# Altium schematic sheet 01_CPU.SchDoc
size A3; DocumentNumber: 1; SheetNumber: 1; SheetTotal: 5
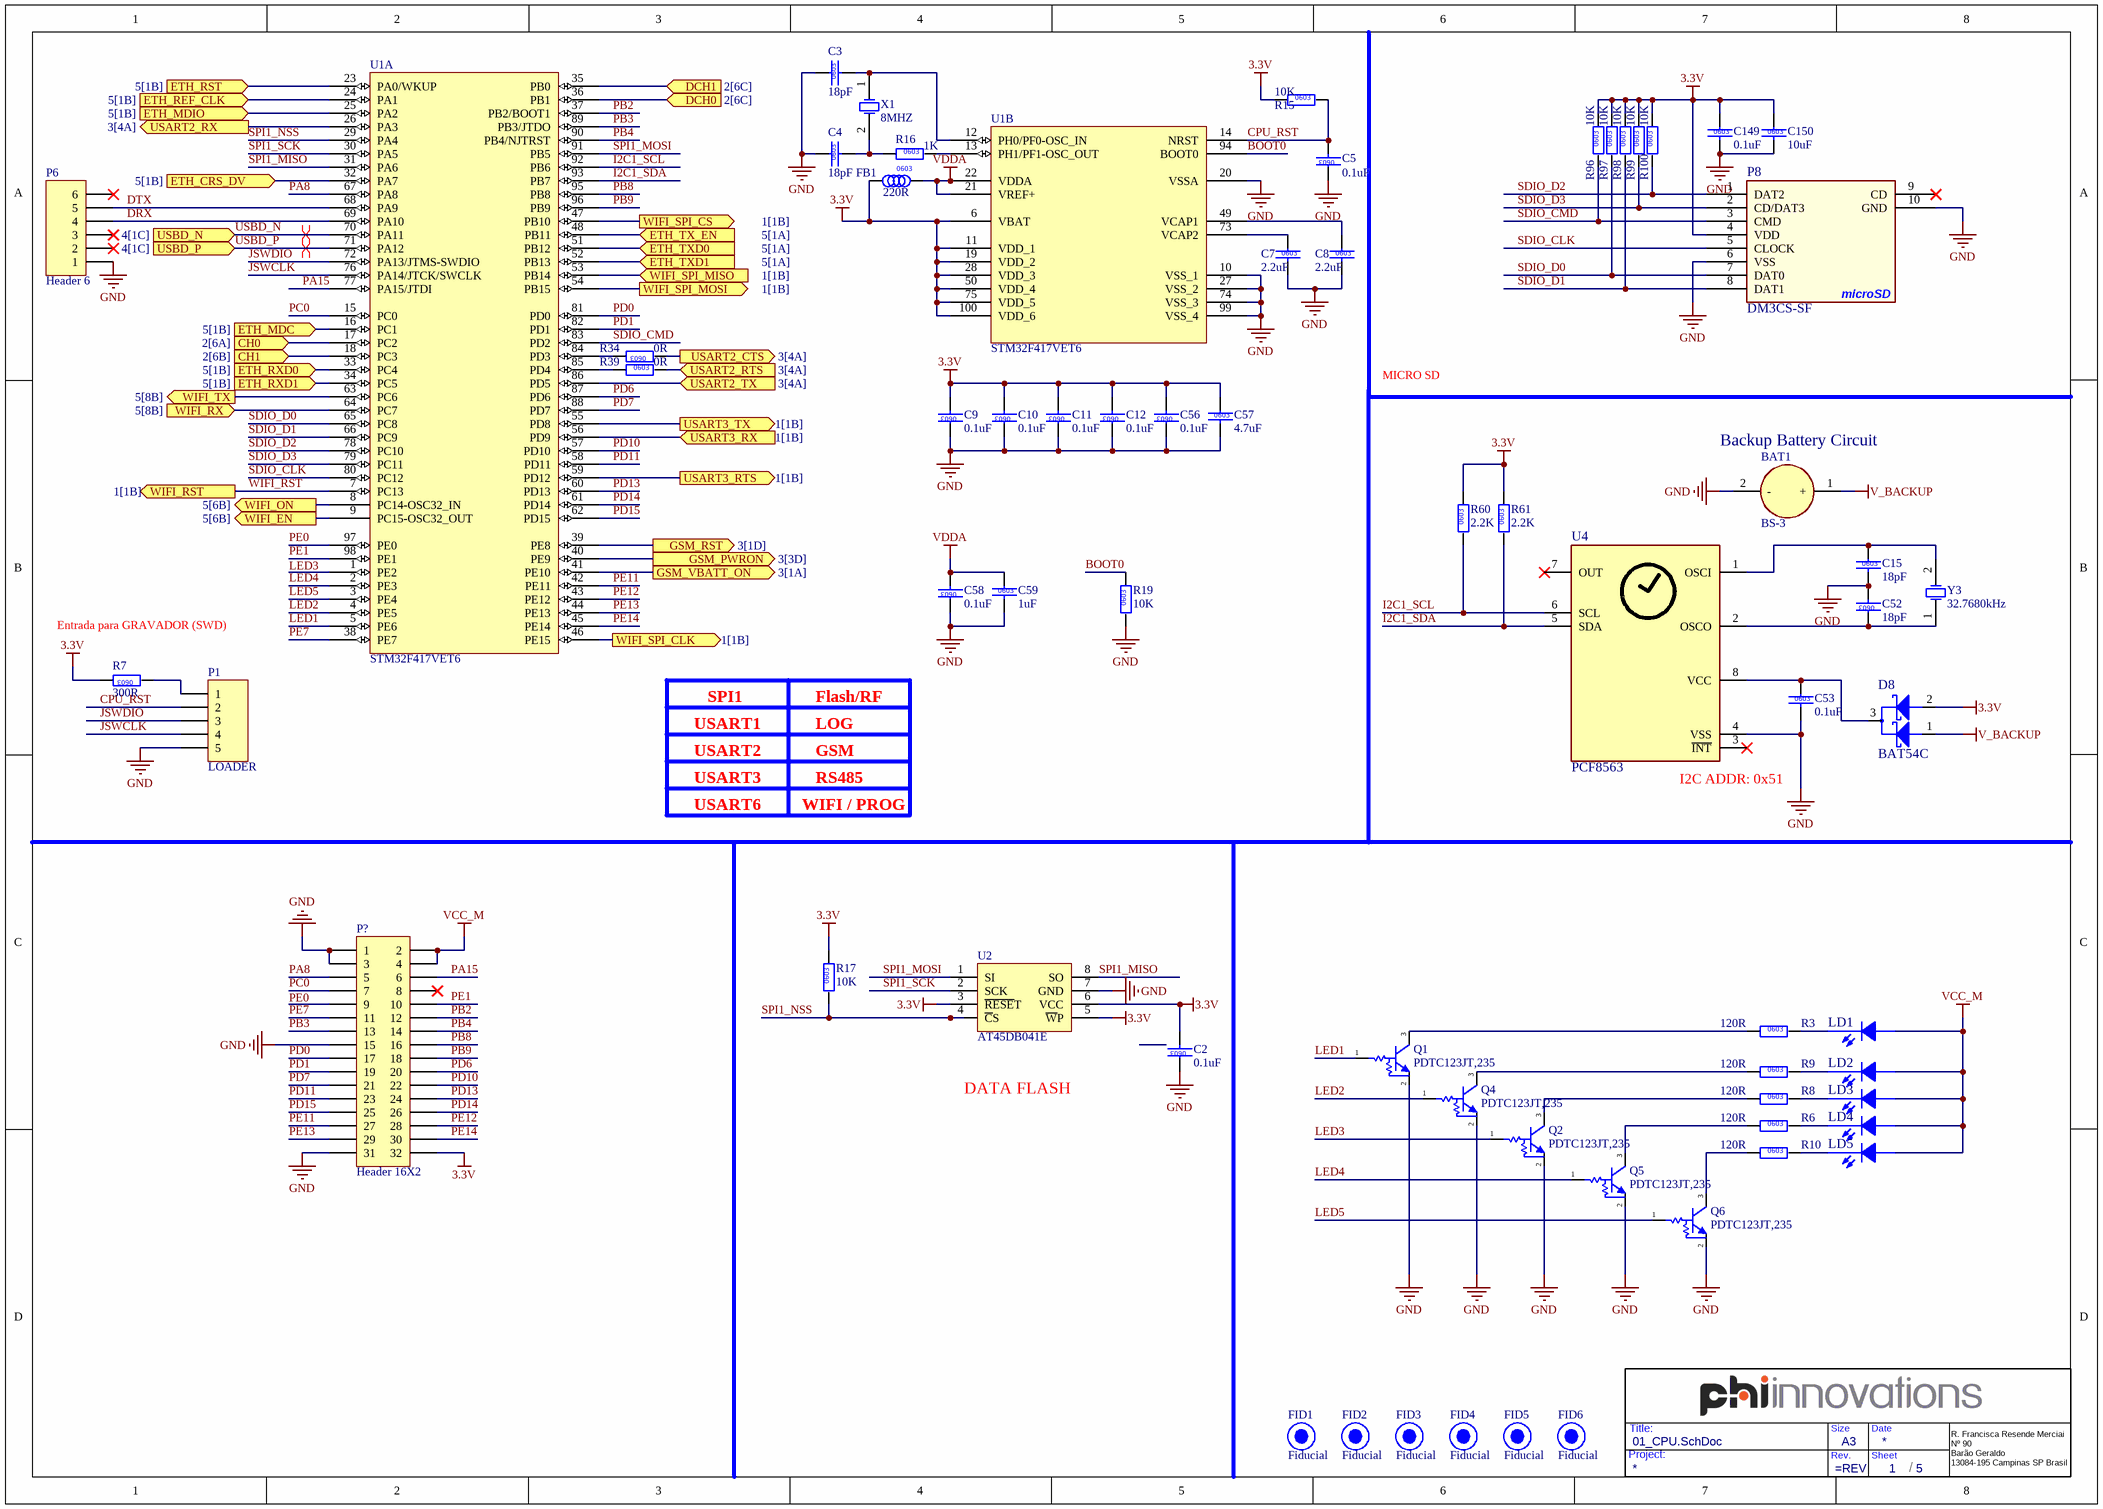
[diagram p0: 01_CPU.SchDoc]

## Parts
?  (no value)  (graphical)
BAT1  BS-3  [BAT_BS-3]
C2  0.1uF  [0603C]
C3  18pF  [0603C]
C4  18pF  [0603C]
C5  0.1uF  [0603C]
C7  2.2uF  [0603C]
C8  2.2uF  [0603C]
C9  0.1uF  [0603C]
C10  0.1uF  [0603C]
C11  0.1uF  [0603C]
C12  0.1uF  [0603C]
C15  18pF  [0603C]
C52  18pF  [0603C]
C53  0.1uF  [0603C]
C56  0.1uF  [0603C]
C57  4.7uF  [0603C]
C58  0.1uF  [0603C]
C59  1uF  [0603C]
C149  0.1uF  [0603C]
C150  10uF  [0603C]
D8  BAT54C  [SOT-23-3]
FB1  220R  [0603L]
FID1  Fiducial  [Fiducial Top]  (no BOM)
FID2  Fiducial  [Fiducial Top]  (no BOM)
FID3  Fiducial  [Fiducial Top]  (no BOM)
FID4  Fiducial  [Fiducial Top]  (no BOM)
FID5  Fiducial  [Fiducial Top]  (no BOM)
FID6  Fiducial  [Fiducial Top]  (no BOM)
LD1  LTST-S321KGKT  [LED_1208]  (value not drawn)
LD2  LTST-S321KGKT  [LED_1208]  (value not drawn)
LD3  LTST-S321KGKT  [LED_1208]  (value not drawn)
LD4  LTST-S321KGKT  [LED_1208]  (value not drawn)
LD5  LTST-S321KGKT  [LED_1208]  (value not drawn)
P1  LOADER  [HDR1X5]
P6  Header 6  [HDR1X6]
P8  DM3CS-SF  [CONN_DM3SC]
P?  Header 16X2  [HDR2X16]
Q1  PDTC123JT,235  [SOT-23-3]
Q2  PDTC123JT,235  [SOT-23-3]
Q4  PDTC123JT,235  [SOT-23-3]
Q5  PDTC123JT,235  [SOT-23-3]
Q6  PDTC123JT,235  [SOT-23-3]
R3  120R  [0603R]
R6  120R  [0603R]
R7  300R  [0603R]
R8  120R  [0603R]
R9  120R  [0603R]
R10  120R  [0603R]
R15  10K  [0603R]
R16  1K  [0603R]
R17  10K  [0603R]
R19  10K  [0603R]
R34  0R  [0603R]
R39  0R  [0603R]
R60  2.2K  [0603R]
R61  2.2K  [0603R]
R96  10K  [0603R]
R97  10K  [0603R]
R98  10K  [0603R]
R99  10K  [0603R]
R100  10K  [0603R]
U1  STM32F417VET6  [LQFP100]  (parts A,B of 2)
U2  AT45DB041E  [SOIC8]
U4  PCF8563  [SOIC8]
X1  8MHZ  [HC49]
Y3  32.7680kHz  [XTAL_32KHZ]

## Ports
CH0 (in, see 2[6A]), CH1 (in, see 2[6B]), DCH0 (in, see 2[6C]), DCH1 (in, see 2[6C]), ETH_CRS_DV (in, see 5[1B]), ETH_MDC (in, see 5[1B]), ETH_MDIO (in, see 5[1B]), ETH_REF_CLK (in, see 5[1B]), ETH_RST (in, see 5[1B]), ETH_RXD0 (in, see 5[1B]), ETH_RXD1 (in, see 5[1B]), ETH_TX_EN (in, see 5[1A]), ETH_TXD0 (in, see 5[1A]), ETH_TXD1 (in, see 5[1A]), GSM_PWRON (out, see 3[3D]), GSM_RST (out, see 3[1D]), GSM_VBATT_ON (out, see 3[1A]), USART2_CTS (out, see 3[4A]), USART2_RTS (in, see 3[4A]), USART2_RX (out, see 3[4A]), USART2_TX (in, see 3[4A]), USART3_RTS (out, see 1[1B]), USART3_RX (in, see 1[1B]), USART3_TX (out, see 1[1B]), USBD_N (in, see 4[1C]), USBD_P (in, see 4[1C]), WIFI_EN (out, see 5[6B]), WIFI_ON (out, see 5[6B]), WIFI_RST (out, see 1[1B]), WIFI_RX (in, see 5[8B]), WIFI_SPI_CLK (out, see 1[1B]), WIFI_SPI_CS (out, see 1[1B]), WIFI_SPI_MISO (in, see 1[1B]), WIFI_SPI_MOSI (out, see 1[1B]), WIFI_TX (out, see 5[8B])

## Nets
3.3V: C2.2 C9.2 C10.2 C11.2 C12.2 C56.2 C57.1 C149.1 C150.1 D8.2(ANODE2) FB1.1 P8.4(VDD) P?.32 R7.2 R15.1 R17.2 R60.2 R61.2 R96.2 R97.2 R98.2 R99.2 R100.2 U1.6(VBAT) U1.11(VDD_1) U1.19(VDD_2) U1.28(VDD_3) U1.50(VDD_4) U1.75(VDD_5) U1.100(VDD_6) U2.3(~{RESE}T) U2.5(~{W}P) U2.6(VCC)
GND: BAT1.2(-) C2.1 C3.1 C4.1 C5.1 C7.2 C8.2 C9.1 C10.1 C11.1 C12.1 C15.2 C52.2 C53.2 C56.1 C57.2 C58.1 C59.2 C149.2 C150.2 P1.5 P6.1 P8.6(VSS) P8.10(GND) P?.1 P?.3 P?.15 P?.31 Q1.2(E) Q2.2(E) Q4.2(E) Q5.2(E) Q6.2(E) R19.1 U1.10(VSS_1) U1.20(VSSA) U1.27(VSS_2) U1.74(VSS_3) U1.99(VSS_4) U2.7(GND) U4.4(VSS)
V_BACKUP: BAT1.1(+) D8.1(ANODE1)
VCC_M: LD1.A LD2.A LD3.A LD4.A LD5.A P?.2 P?.4
VDDA: C58.2 C59.1 FB1.2 U1.21(VREF+) U1.22(VDDA)
BOOT0: R19.2 U1.94(BOOT0)
CH0: U1.17(PC2) ; port CH0
CH1: U1.18(PC3) ; port CH1
CPU_RST: C5.2 P1.2 R15.2 U1.14(NRST)
DCH0: U1.36(PB1) ; port DCH0
DCH1: U1.35(PB0) ; port DCH1
DRX: P6.4 U1.69(PA10)
DTX: P6.5 U1.68(PA9)
ETH_CRS_DV: U1.32(PA7) ; port ETH_CRS_DV
ETH_MDC: U1.16(PC1) ; port ETH_MDC
ETH_MDIO: U1.25(PA2) ; port ETH_MDIO
ETH_REF_CLK: U1.24(PA1) ; port ETH_REF_CLK
ETH_RST: U1.23(PA0/WKUP) ; port ETH_RST
ETH_RXD0: U1.33(PC4) ; port ETH_RXD0
ETH_RXD1: U1.34(PC5) ; port ETH_RXD1
ETH_TX_EN: U1.48(PB11) ; port ETH_TX_EN
ETH_TXD0: U1.51(PB12) ; port ETH_TXD0
ETH_TXD1: U1.52(PB13) ; port ETH_TXD1
GSM_PWRON: U1.40(PE9) ; port GSM_PWRON
GSM_RST: U1.39(PE8) ; port GSM_RST
GSM_VBATT_ON: U1.41(PE10) ; port GSM_VBATT_ON
I2C1_SCL: R60.1 U1.92(PB6) U4.6(SCL)
I2C1_SDA: R61.1 U1.93(PB7) U4.5(SDA)
JSWCLK: P1.4 U1.76(PA14/JTCK/SWCLK)
JSWDIO: P1.3 U1.72(PA13/JTMS-SWDIO)
LED1: Q1.1(B) U1.5(PE6)
LED2: Q4.1(B) U1.4(PE5)
LED3: Q2.1(B)
LED4: Q5.1(B) U1.2(PE3)
LED5: Q6.1(B) U1.3(PE4)
PA8: P?.5 U1.67(PA8)
PA15: P?.6 U1.77(PA15/JTDI)
PB2: P?.12 U1.37(PB2/BOOT1)
PB3: P?.13 U1.89(PB3/JTDO)
PB4: P?.14 U1.90(PB4/NJTRST)
PB8: P?.16 U1.95(PB8)
PB9: P?.18 U1.96(PB9)
PC0: P?.7 U1.15(PC0)
PD0: P?.17 U1.81(PD0)
PD1: P?.19 U1.82(PD1)
PD6: P?.20 U1.87(PD6)
PD7: P?.21 U1.88(PD7)
PD10: P?.22 U1.57(PD10)
PD11: P?.23 U1.58(PD11)
PD13: P?.24 U1.60(PD13)
PD14: P?.26 U1.61(PD14)
PD15: P?.25 U1.62(PD15)
PE0: U1.97(PE0)
PE1: P?.10 U1.98(PE1)
PE7: P?.11 U1.38(PE7)
PE11: P?.27 U1.42(PE11)
PE12: P?.28 U1.43(PE12)
PE13: P?.29 U1.44(PE13)
PE14: P?.30 U1.45(PE14)
SDIO_CLK: P8.5(CLOCK) U1.80(PC12)
SDIO_CMD: P8.3(CMD) R96.1 U1.83(PD2)
SDIO_D0: P8.7(DAT0) R97.1 U1.65(PC8)
SDIO_D1: P8.8(DAT1) R98.1 U1.66(PC9)
SDIO_D2: P8.1(DAT2) R100.1 U1.78(PC10)
SDIO_D3: P8.2(CD/DAT3) R99.1 U1.79(PC11)
SPI1_MISO: U1.31(PA6) U2.8(SO)
SPI1_MOSI: U1.91(PB5) U2.1(SI)
SPI1_NSS: R17.1 U1.29(PA4) U2.4(~{C}S)
SPI1_SCK: U1.30(PA5) U2.2(SCK)
USART2_CTS: R34.1 ; port USART2_CTS
USART2_RTS: R39.2 ; port USART2_RTS
USART2_RX: U1.26(PA3) ; port USART2_RX
USART2_TX: U1.86(PD5) ; port USART2_TX
USART3_RTS: U1.59(PD12) ; port USART3_RTS
USART3_RX: U1.56(PD9) ; port USART3_RX
USART3_TX: U1.55(PD8) ; port USART3_TX
USBD_N: U1.70(PA11) ; port USBD_N
USBD_P: U1.71(PA12) ; port USBD_P
WIFI_EN: U1.9(PC15-OSC32_OUT) ; port WIFI_EN
WIFI_ON: U1.8(PC14-OSC32_IN) ; port WIFI_ON
WIFI_RST: U1.7(PC13) ; port WIFI_RST
WIFI_RX: U1.64(PC7) ; port WIFI_RX
WIFI_SPI_CLK: U1.46(PE15) ; port WIFI_SPI_CLK
WIFI_SPI_CS: U1.47(PB10) ; port WIFI_SPI_CS
WIFI_SPI_MISO: U1.53(PB14) ; port WIFI_SPI_MISO
WIFI_SPI_MOSI: U1.54(PB15) ; port WIFI_SPI_MOSI
WIFI_TX: U1.63(PC6) ; port WIFI_TX
NetC3_2: C3.2 U1.12(PH0/PF0-OSC_IN) X1.1(OSC1)
NetC4_2: C4.2 R16.1 X1.2(OSC2)
NetC7_1: C7.1 U1.73(VCAP2)
NetC8_1: C8.1 U1.49(VCAP1)
NetC15_1: C15.1 U4.1(OSCI) Y3.2(OSC2)
NetC52_1: C52.1 U4.2(OSCO) Y3.1(OSC1)
NetC53_1: C53.1 D8.3(CATHODE) U4.8(VCC)
NetLD1_K: LD1.K(C) R3.2
NetLD2_K: LD2.K(C) R9.2
NetLD3_K: LD3.K(C) R8.2
NetLD4_K: LD4.K(C) R6.2
NetLD5_K: LD5.K(C) R10.2
NetP1_1: P1.1 R7.1
NetQ1_3: Q1.3(C) R3.1
NetQ2_3: Q2.3(C) R8.1
NetQ4_3: Q4.3(C) R9.1
NetQ5_3: Q5.3(C) R6.1
NetQ6_3: Q6.3(C) R10.1
NetR16_2: R16.2 U1.13(PH1/PF1-OSC_OUT)
NetR34_2: R34.2 U1.84(PD3)
NetR39_1: R39.1 U1.85(PD4)

Not connected (* = marked no-connect by the designer): P6 2* 3* 6*; P8 9(CD)*; P? 8* 9; U1 1(PE2); U4 3(~{INT})* 7(OUT)*

## Layout directives
differential pair: USBD_N, USBD_P

## Notes on the sheet
- MICRO SD
- (near BAT1) Backup Battery Circuit
- Entrada para GRAVADOR (SWD)
- SPI1
- Flash/RF
- USART1
- USART3
- USART2
- LOG
- GSM
- RS485
- (near U4) I2C ADDR: 0x51
- USART6
- WIFI / PROG
- DATA FLASH
- Labels drawn without touching a wire or pin: LED3, PE0
- Project:
- Title:
- Rev.
- Size
- Sheet
- Date
- /
- R. Francisca Resende Merciai
  Nº 90
  Barão Geraldo
  13084-195 Campinas SP Brasil
- (in symbol CAP0603) 0603
- (in symbol PHI100.0.0603.000R.001.1/10W) 0603
- (in symbol PHI100.0.0603.001K.001.1/10W) 0603
- (in symbol PHI100.0.0603.02K2.001.1/10W) 0603
- (in symbol PHI100.0.0603.120R.001.1/10W) 0603
- (in symbol PHI100.0.0603.300R.005.1/10W) 0603
- (in symbol PHI101.0.0603.010K.001.1/10W) 0603
- (in symbol PHI201.0.0603.000u1.005.050V.X7R) 0603
- (in symbol PHI201.0.0603.0001u.010.025V.X5R) 0603
- (in symbol PHI201.0.0603.002u2.010.025V.X5R) 0603
- (in symbol PHI201.0.0603.004u7.010.016V.X7R) 0603
- (in symbol PHI201.0.0603.0010u.010.016V.X5R) 0603
- (in symbol PHI201.0.0603.0018p.005.050V.C0G) 0603
- (in symbol PHI350.0.0603.0220R.XXX.0002A.050mOHM) 0603
- (in symbol PHI770.0.F.DM3CS-SF) microSD
- (in symbol RES0603) 0603

## Library data of the parts
? = Title_Block3
BAT1 = PHI940.BS-3: HOLDER COINCELL 2032 RETAINR ARM; Fabricante 1: MPD; Partnumber PHI: PHI940.BS-3; Partnumber fabricante 1: BS-3; Datasheet fabricante 1: http://www.memoryprotectiondevices.com/datasheets/BS-3-datasheet.pdf; Distribuidor 1: Digi Key; PN distribuidor 1 / Fab 1: BS-3-ND; Distribuidor 2: Mouser; P Description: HOLDER COINCELL 2032 RETAINR ARM; Value: BS-3
C2 C5 C9-C12 C53 C56 C58 = PHI201.0.0603.000u1.005.050V.X7R: CAP0603; Partnumber fabricante 1: 06035C104JAT2A; Fabricante 1: AVX Corporation; P Description: Capacitor ceramico 0603 0.1uF 20% 50V X7R; SCH Info: GERAL; Datasheet fabricante 1: http://datasheets.avx.com/X7RDielectric.pdf; Distribuidor 1: Digi Key; Distribuidor 2: Mouser; Partnumber PHI: PHI201.0.0603.000u1.005.050V.X7R; PN distribuidor 1 / Fab 1: 478-5778-1-ND; Value: 0.1uF
C3 C4 = CAP0603: Part Number: CAP CER 18PF 50V NP0 0603; Partnumber fabricante 1: GRM1885C1H180JA01D; Partnumber PHI: PHI201.0.0603.0018p.005.050V.C0G; Fabricante 1: Murata Electronics North America; P Description: Capacitor ceramico 0603 18pF 5% 50V C0G; SCH Info: GERAL; Supplier 1: Digi-Key; Supplier Part Number 1: 478-1166-1-ND; Datasheet fabricante 1: http://www.murata.com/~/media/webrenewal/support/library/catalog/products/capacitor/mlcc/c02e.pdf; Distribuidor 1: Digi Key; Distribuidor 2: Mouser; PN distribuidor 1 / Fab 1: 490-1409-1-ND; Value: 18pF
C7 C8 = PHI201.0.0603.002u2.010.025V.X5R: CAP0603; Partnumber fabricante 1: GRM188R61E225MA12D; Fabricante 1: Murata Electronics North America; Fabricante 2: Samsung Electro-Mechanics America, Inc.; P Description: Capacitor ceramico 0603 1uF 5% 25V X5R; SCH Info: GERAL; Partnumber PHI: PHI201.0.0603.002u2.010.025V.X5R; Datasheet fabricante 1: http://www.murata.com/~/media/webrenewal/support/library/catalog/products/capacitor/mlcc/c02e.pdf; Partnumber fabricante 2: CL10A225KL8NNNC; Datasheet fabricante 2: http://www.samsungsem.com/kr/front/downloadcms.do?path=/kr/support/product-search/mlcc/__icsFiles/afieldfile/2014/11/05&fileName=C_CL10A105KA5LNNC.pdf; Distribuidor 1: Digi Key; PN distribuidor 1 / Fab 1: 490-12738-1-ND; PN distribuidor 1 / Fab 2: 1276-6726-1-ND; Distribuidor 2: Mouser; Value: 2.2uF
C15 C52 = PHI201.0.0603.0018p.005.050V.C0G: CAP0603; Partnumber fabricante 1: GRM1885C1H180JA01D; Fabricante 1: Murata Electronics North America; P Description: Capacitor ceramico 0603 18pF 5% 50V C0G; SCH Info: GERAL; Partnumber PHI: PHI201.0.0603.0018p.005.050V.C0G; Datasheet fabricante 1: http://www.murata.com/~/media/webrenewal/support/library/catalog/products/capacitor/mlcc/c02e.pdf; Distribuidor 1: Digi Key; PN distribuidor 1 / Fab 1: 490-1409-1-ND; Distribuidor 2: Mouser; Value: 18pF
C57 = PHI201.0.0603.004u7.010.016V.X7R: CAP0603; Partnumber fabricante 1: CL10A475KO8NNNC; Fabricante 1: Samsung Electro-Mechanics America, Inc; Fabricante 2: Taiyo Yuden; P Description: Capacitor ceramico 0603 4.7uF 10% 16V X7R; SCH Info: GERAL; Partnumber PHI: PHI201.0.0603.004u7.010.016V.X7R; Datasheet fabricante 1: http://www.samsungsem.com/kr/support/product-search/mlcc/CL10A475KO8NNNC.jsp; Partnumber fabricante 2: EMK107ABJ475KA-T; Datasheet fabricante 2: http://ds.yuden.co.jp/TYCOMPAS/ut/detail.do?productNo=EMK107ABJ475KA-T&fileName=EMK107ABJ475KA-T_SS&mode=specSheetDownload; Distribuidor 1: Digi Key; PN distribuidor 1 / Fab 1: 1276-1784-1-ND; PN distribuidor 1 / Fab 2: 587-2786-1-ND; Distribuidor 2: Mouser; Value: 4.7uF
C59 = PHI201.0.0603.0001u.010.025V.X5R: CAP0603; Partnumber fabricante 1: GRM188R61E105KA12D; Fabricante 1: Murata Electronics North America; Fabricante 2: Samsung Electro-Mechanics America, Inc.; P Description: Capacitor ceramico 0603 1uF 5% 25V X5R; SCH Info: GERAL; Partnumber PHI: PHI201.0.0603.0001u.010.025V.X5R; Datasheet fabricante 1: http://www.murata.com/~/media/webrenewal/support/library/catalog/products/capacitor/mlcc/c02e.pdf; Partnumber fabricante 2: CL10A105KA5LNNC; Datasheet fabricante 2: http://www.samsungsem.com/kr/front/downloadcms.do?path=/kr/support/product-search/mlcc/__icsFiles/afieldfile/2014/11/05&fileName=C_CL10A105KA5LNNC.pdf; Distribuidor 1: Digi Key; PN distribuidor 1 / Fab 1: 490-3897-1-ND; PN distribuidor 1 / Fab 2: 1276-1858-1-ND; Distribuidor 2: Mouser; Value: 1uF
C149 = PHI201.0.0603.000u1.005.050V.X7R: CAP0603; Partnumber fabricante 1: 06035C104JAT2A; Fabricante 1: AVX Corporation; P Description: Capacitor ceramico 0603 0.1uF 20% 50V X7R; Partnumber PHI: PHI201.0.0603.000u1.005.050V.X7R; Datasheet fabricante 1: http://datasheets.avx.com/X7RDielectric.pdf; Distribuidor 1: Digi Key; PN distribuidor 1 / Fab 1: 478-5778-1-ND; Distribuidor 2: Mouser; Value: 0.1uF
C150 = PHI201.0.0603.0010u.010.016V.X5R: Ceramic capacitor 10uF 16V X5R 10% 0603; Partnumber fabricante 1: GRM188R61C106KAALD; Fabricante 1: Murata Electronics North America; P Description: Capacitor ceramico 0603 10uF 5% 16V X7R; Partnumber PHI: PHI201.0.0603.0010u.010.016V.X5R; Datasheet fabricante 1: http://www.murata.com/~/media/webrenewal/support/library/catalog/products/capacitor/mlcc/c02e.pdf; Distribuidor 1: Digi Key; PN distribuidor 1 / Fab 1: 490-10728-1-ND; Distribuidor 2: Mouser; Value: 10uF
D8 = PHI420.0.BAT54C-7-F: BAT54C-7-F; Fabricante 1: Diodes Incorporated; P Description: Diodo Array Schottky Small Sig SOT-23-3 30V 1 Pair Common Cathode; SCH Info: GERAL; Partnumber PHI: PHI420.0.BAT54C-7-F; Partnumber fabricante 1: BAT54C-7-F; Datasheet fabricante 1: http://www.diodes.com/_files/datasheets/ds11005.pdf; Distribuidor 1: Digi Key; PN distribuidor 1 / Fab 1: BAT54C-FDICT-ND; Distribuidor 2: Mouser; Value: BAT54C
FB1 = PHI350.0.0603.0220R.XXX.0002A.050mOHM: FB0603; Partnumber fabricante 1: BLM18EG221SN1D; Fabricante 1: Murata Electronics North America; P Description: Ferrite Bead Chip 0603 220OHM 2A 50mOHM; SCH Info: GERAL; Partnumber PHI: PHI350.0.0603.0220R.XXX.0002A.050mOHM; Datasheet fabricante 1: http://search.murata.co.jp/Ceramy/image/img/PDF/ENG/L0110S0101BLM18E.pdf; Distribuidor 1: Digi Key; PN distribuidor 1 / Fab 1: 490-3992-1-ND; Distribuidor 2: Mouser; Value: 220R
FID1-FID6 = Fiducial: PCB Info: DNP
LD1-LD5 = LED: Fabricante 1: Lite-On; P Description: Standard LEDs - SMD Green 571nm 35mcd Clear; SCH Info: GERAL; Partnumber fabricante 1: LTST-S321KGKT; Value: LTST-S321KGKT
P1 = Header 5: HEADER MALE 5-Pin 2.54MM PITCH; Part Number: HEADER MALE 5x1Pin 2.54MM PITCH; Partnumber fabricante 1: Header 2.54mm; SCH Info: GERAL; Supplier 1: Digi-Key
P6 = Header 6: Header, 6-Pin; Partnumber fabricante 1: Header 2.54mm; SCH Info: GERAL
P8 = PHI770.0.F.DM3CS-SF: microSD_CONN_8; Fabricante 1: Hirose Electric Co Ltd; P Description: CONN MICRO SD CARD HINGED TYPE; Partnumber PHI: PHI770.0.F.DM3CS-SF; Partnumber fabricante 1: DM3CS-SF; Datasheet fabricante 1: https://www.hirose.com/product/en/download_file/key_name/DM3/category/Catalog/doc_file_id/49662/?file_category_id=4&item_id=195&is_series=1; Distribuidor 1: Digi Key; PN distribuidor 1 / Fab 1: HR1972CT-ND; Value: DM3CS-SF
P? = Header 16X2: Header, 16-Pin, Dual row; LatestRevisionDate: 17-Jul-2002; LatestRevisionNote: Re-released for DXP Platform.; Publisher: Altium Limited
Q1 Q2 Q4-Q6 = PHI530.0.PDTC123JT,235: BJT_PB_NPN_SOT23-3; Fabricante 1: NXP Semiconductors; P Description: TRANS PREBIAS NPN 250MW TO236AB; SCH Info: GERAL; Partnumber PHI: PHI530.0.PDTC123JT,235; Partnumber fabricante 1: PDTC123JT,235; Datasheet fabricante 1: http://www.nxp.com/documents/data_sheet/PDTC123J_SER.pdf; Distribuidor 1: Digi Key; PN distribuidor 1 / Fab 1: 568-2154-1-ND; Distribuidor 2: Mouser; Value: PDTC123JT,235
R3 R6 R8-R10 = PHI100.0.0603.120R.001.1/10W: RES0603; Partnumber fabricante 1: RC0603FR-07120RL; Fabricante 1: Yageo; P Description: Resistor SMD 0603 120R 1% 1/16W; SCH Info: GERAL; Partnumber PHI: PHI100.0.0603.120R.001.1/10W; Datasheet fabricante 1: http://www.yageo.com.tw/exep/pages/download/literatures/PYu-R_INT-thick_7.pdf; Distribuidor 1: Digi Key; PN distribuidor 1 / Fab 1: 311-120HRCT-ND; Distribuidor 2: Mouser; Value: 120R
R7 = PHI100.0.0603.300R.005.1/10W: RES0603; Partnumber fabricante 1: RC0603JR-07300RL; Fabricante 1: Yageo; P Description: Resistor SMD 0603 300R 5% 1/10W; SCH Info: MODBUS; Partnumber PHI: PHI100.0.0603.300R.005.1/10W; Datasheet fabricante 1: http://www.yageo.com.tw/exep/pages/download/literatures/PYu-R_INT-thick_7.pdf; Distribuidor 1: Digi Key; PN distribuidor 1 / Fab 1: 311-300GRTR-ND; Value: 300R
R15 R19 = PHI101.0.0603.010K.001.1/10W: RES0603; Partnumber fabricante 1: RC0603FR-0710KL; Fabricante 1: Yageo; Fabricante 2: Stackpole Electronics Inc; P Description: Resistor SMD 0603 10K 1% 1/08W; SCH Info: GERAL; Partnumber PHI: PHI101.0.0603.010K.001.1/10W; Datasheet fabricante 1: http://www.yageo.com/documents/recent/PYu-RC_Group_51_RoHS_L_04.pdf; Partnumber fabricante 2: RNCP0603FTD10K0; Datasheet fabricante 2: http://www.seielect.com/catalog/SEI-RNCP.pdf; Distribuidor 1: Digi Key; PN distribuidor 1 / Fab 1: 311-10.0KHRCT-ND; PN distribuidor 1 / Fab 2: RMCF0603FT10K0CT-ND; Distribuidor 2: Mouser; Value: 10K
R16 = PHI100.0.0603.001K.001.1/10W: RES0603; Partnumber fabricante 1: RC0603FR-071KL; Fabricante 1: Yageo; Fabricante 2: Panasonic Electronic Components; P Description: Resistor SMD 0603 1K 1% 1/10W; SCH Info: GERAL; Partnumber PHI: PHI100.0.0603.001K.001.1/10W; Datasheet fabricante 1: http://www.yageo.com/NewPortal/yageodocoutput?fileName=/pdf/R-Chip/PYu-RC_Group_51_RoHS_L_3.pdf; Partnumber fabricante 2: ERJ-3EKF1001V; Datasheet fabricante 2: http://industrial.panasonic.com/www-cgi/jvcr13pz.cgi?E+PZ+3+AOA0002+ERJ3EKF1001V+7+WW; Distribuidor 1: Digi Key; PN distribuidor 1 / Fab 1: 311-1.00KHRCT-ND; PN distribuidor 1 / Fab 2: P1.00KHCT-ND; Distribuidor 2: Mouser; Value: 1K
R17 = RES0603: Part Number: RES_0603_1%_10k; Partnumber fabricante 1: RC0603FR-0710KL; Partnumber PHI: PHI101.0.0603.010K.001.1/10W; Fabricante 1: Yageo; P Description: Resistor SMD 0603 10K 1% 1/08W; Fabricante 2: Stackpole Electronics Inc; SCH Info: GERAL; Supplier 1: Digi-Key; Supplier Part Number 1: 311-10.0KHRCT-ND; Datasheet fabricante 1: http://www.yageo.com/documents/recent/PYu-RC_Group_51_RoHS_L_04.pdf; Distribuidor 1: Digi Key; Distribuidor 2: Mouser; PN distribuidor 1 / Fab 1: 311-10.0KHRCT-ND; Value: 10K; Datasheet fabricante 2: http://www.seielect.com/catalog/SEI-RNCP.pdf; Partnumber fabricante 2: RNCP0603FTD10K0; PN distribuidor 1 / Fab 2: RMCF0603FT10K0CT-ND
R34 R39 = PHI100.0.0603.000R.001.1/10W: RES0603; Partnumber fabricante 1: RC0603JR-070RL; Fabricante 1: Yageo; Fabricante 2: Panasonic Electronic Components; P Description: Resistor SMD 0603 0R JUMPER 1/10W; SCH Info: GERAL; Partnumber PHI: PHI100.0.0603.000R.001.1/10W; Datasheet fabricante 1: http://www.yageo.com/NewPortal/yageodocoutput?fileName=/pdf/R-Chip/PYu-RC_Group_51_RoHS_L_3.pdf; Partnumber fabricante 2: ERJ-3GEY0R00V; Datasheet fabricante 2: http://industrial.panasonic.com/www-cgi/jvcr13pz.cgi?E+PZ+3+AOA0001+ERJ3GEY0R00V+7+WW; Distribuidor 1: Digi Key; PN distribuidor 1 / Fab 1: 311-0.0GRCT-ND; PN distribuidor 1 / Fab 2: P0.0GTR-ND; Distribuidor 2: Mouser; Value: 0R
R60 R61 = PHI100.0.0603.02K2.001.1/10W: RES0603; Partnumber fabricante 1: RC0603FR-072K2L; Fabricante 1: Yageo; Fabricante 2: Stackpole Electronics Inc; P Description: Resistor SMD 0603 2.2K 1% 1/10W; SCH Info: GERAL; Partnumber PHI: PHI100.0.0603.02K2.001.1/10W; Datasheet fabricante 1: http://www.yageo.com/NewPortal/yageodocoutput?fileName=/pdf/R-Chip/PYu-RC_Group_51_RoHS_L_3.pdf; Partnumber fabricante 2: RMCF0603FT2K20; Datasheet fabricante 2: http://www.seielect.com/Catalog/SEI-RMCF_RMCP.pdf; Distribuidor 1: Digi Key; PN distribuidor 1 / Fab 1: 311-2.20KHRCT-ND; PN distribuidor 1 / Fab 2: RMCF0603FT2K20CT-ND; Distribuidor 2: Mouser; Value: 2.2K
R96-R99 = PHI101.0.0603.010K.001.1/10W: RES0603; Partnumber fabricante 1: RC0603FR-0710KL; Fabricante 1: Yageo; Fabricante 2: Stackpole Electronics Inc; P Description: Resistor SMD 0603 10K 1% 1/08W; Partnumber PHI: PHI101.0.0603.010K.001.1/10W; Datasheet fabricante 1: http://www.yageo.com/documents/recent/PYu-RC_Group_51_RoHS_L_04.pdf; Partnumber fabricante 2: RNCP0603FTD10K0; Datasheet fabricante 2: http://www.seielect.com/catalog/SEI-RNCP.pdf; Distribuidor 1: Digi Key; PN distribuidor 1 / Fab 1: 311-10.0KHRCT-ND; PN distribuidor 1 / Fab 2: RMCF0603FT10K0CT-ND; Distribuidor 2: Mouser; Value: 10K
R100 = PHI101.0.0603.010K.001.1/10W: RES0603; Partnumber fabricante 1: MCT06030C1002FP500; Fabricante 1: Vishay Beyschlag; Fabricante 2: Stackpole Electronics Inc; P Description: Resistor SMD 0603 10K 1% 1/08W; Partnumber PHI: PHI101.0.0603.010K.001.1/10W; Datasheet fabricante 1: http://www.vishay.com/docs/28705/mcx0x0xpro.pdf; Partnumber fabricante 2: RNCP0603FTD10K0; Datasheet fabricante 2: http://www.seielect.com/catalog/SEI-RNCP.pdf; Distribuidor 1: Digi Key; PN distribuidor 1 / Fab 1: MCT0603-10.0K-CFCT-ND; Distribuidor 2: Mouser; Value: 10K
U1 = PHI800.0.STM32F417VET6: Fabricante 1: STMicroelectronics; P Description: IC MCU 32BIT 512KB FLASH 100LQFP; Partnumber PHI: PHI800.0.STM32F417VET6; Partnumber fabricante 1: STM32F417VET6; Datasheet fabricante 1: http://www.st.com/content/ccc/resource/technical/document/datasheet/98/9f/89/73/01/b1/48/98/DM00035129.pdf/files/DM00035129.pdf/jcr:content/translations/en.DM00035129.pdf; Distribuidor 1: Digi Key; PN distribuidor 1 / Fab 1: 497-11901-ND; Distribuidor 2: Mouser; Value: STM32F417VET6
U2 = PHI800.0.MX25L8006EM1I-12G: IC FLASH 8MBIT 86MHZ 8SOP; Manufacturer: Micron Technology Inc.; Part Number: M25P80-VMN6TP; Fabricante 1: Macronix; Value: AT25128B; SCH Info: GERAL; Supplier 1: Digi-Key; Supplier Part Number 1: M25P80-VMN6TPCT-ND; Partnumber PHI: PHI800.0.MX25L8006EM1I-12G; Partnumber fabricante 1: MX25L8006EM1I-12G; Datasheet fabricante 1: http://www.macronix.com/Lists/Datasheet/Attachments/5088/MX25L8006E,%203V,%208Mb,%20v1.5.pdf; Distribuidor 1: Digi Key; PN distribuidor 1 / Fab 1: 1092-1117-ND; Distribuidor 2: Mouser; P Description: IC FLASH 8MBIT 86MHZ 8SOP
U4 = PHI800.0.PCF8563T/5,518: IC RTC CLK/CALENDAR I2C 8SOIC; Manufacturer Name: ST; Part Number: PCF85063AT/AY; Fabricante 1: NXP; P Description: IC RTC CLK/CALENDAR I2C 8-SOIC; SCH Info: GERAL; Partnumber PHI: PHI800.0.PCF8563T/5,518; Partnumber fabricante 1: PCF8563T/5,518; Datasheet fabricante 1: http://www.nxp.com/docs/en/data-sheet/PCF8563.pdf; Distribuidor 1: Digi Key; PN distribuidor 1 / Fab 1: 568-6650-1-ND; Distribuidor 2: Mouser; Value: PCF8563
X1 = PHI600.0.ATS08ASM-1: XTAL_HC49; Fabricante 1: CTS-Frequency Controls; P Description: CRYSTAL 8.0000MHZ 20PF SMD; Partnumber PHI: PHI600.0.ATS08ASM-1; Partnumber fabricante 1: ATS08ASM-1; Datasheet fabricante 1: https://www.ctscorp.com/wp-content/uploads/ATS-ATSSM.pdf; Distribuidor 1: Digi Key; PN distribuidor 1 / Fab 1: CTX506CT-ND; Distribuidor 2: Mouser; Value: 8MHZ
Y3 = PHI600.0.AB38T-32.768KHZ-12.5: XTAL_HC49; Fabricante 1: Abracon LLC; P Description: Cristal 12.5pF ±20ppm 32.7680KHZ; Partnumber PHI: PHI600.0.AB38T-32.768KHZ-12.5; Partnumber fabricante 1: AB38T-32.768KHZ-12.5; Datasheet fabricante 1: http://www.abracon.com/Resonators/AB38T.pdf; Distribuidor 1: Digi Key; Distribuidor 2: Mouser; Value: 32.7680kHz